# Altium schematic sheet PowerManager.SchDoc
size A4
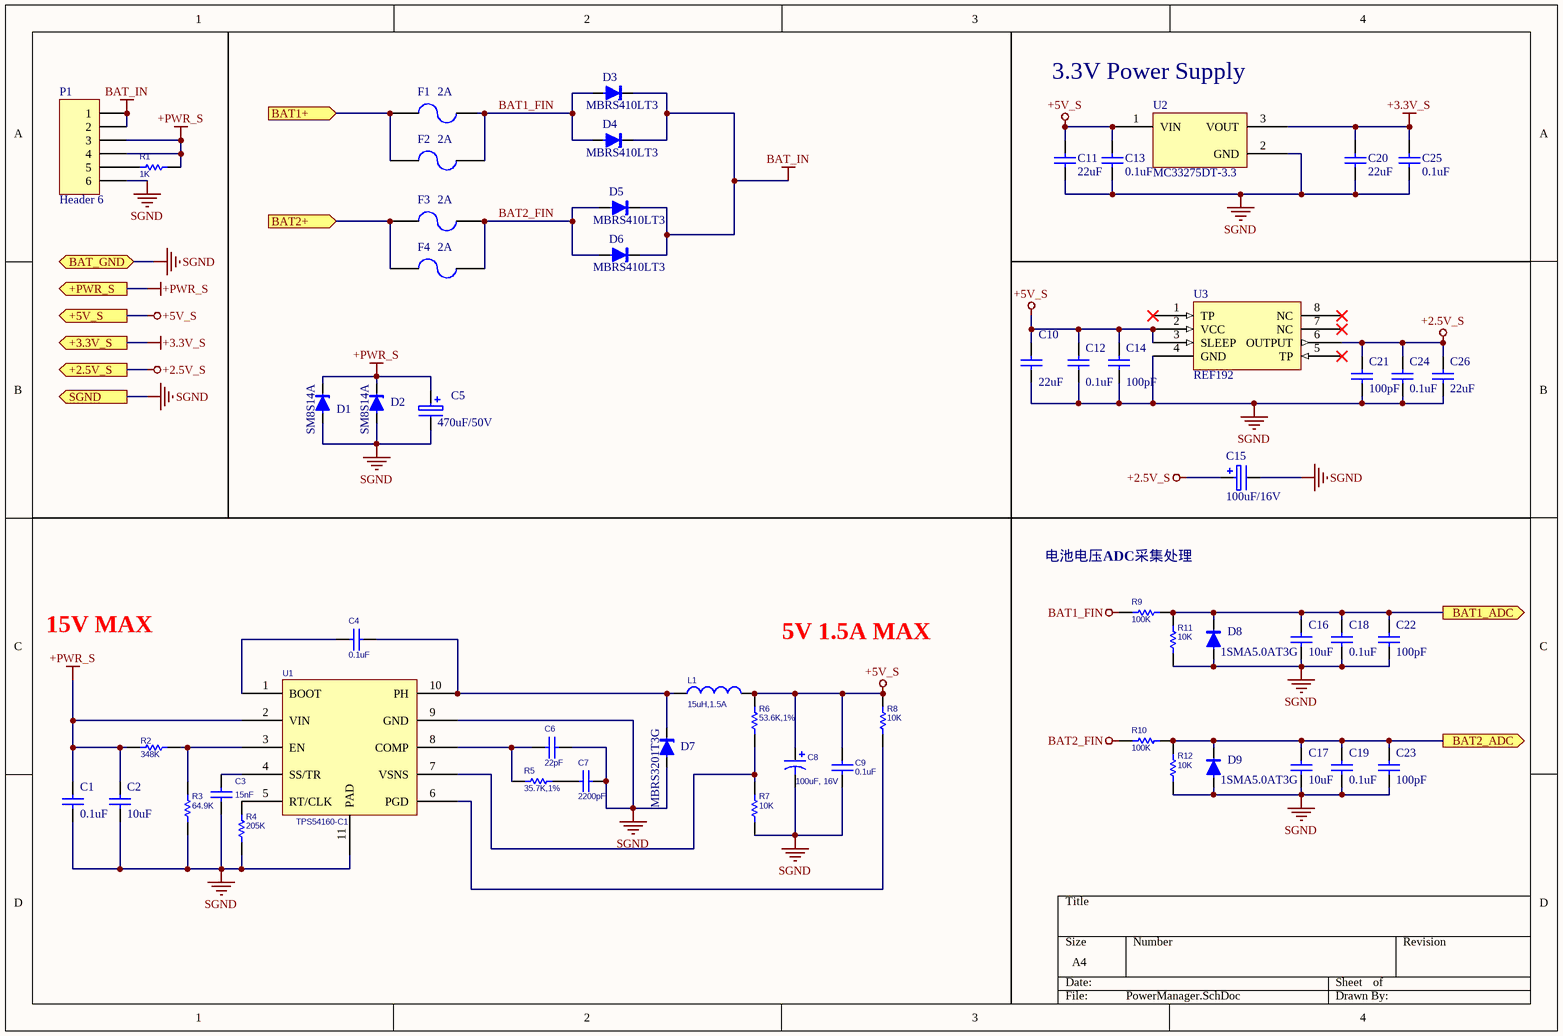
[diagram p0: PowerManager.SchDoc]

## Parts
C1  0.1uF  [C0805]
C2  10uF  [C1206]
C3  15nF  [C0805]
C4  0.1uF  [C0805]
C5  470uF/50V  [CT7343-E]
C6  22pF  [R0805]
C7  2200pF  [C0805]
C8  100uF, 16V  [CT7343-E]
C9  0.1uF  [C0805]
C10  22uF  [C1206]
C11  22uF  [C1206]
C12  0.1uF  [C0805]
C13  0.1uF  [C0805]
C14  100pF  [C0805]
C15  100uF/16V  [CT7343-E]
C16  10uF  [C1206]
C17  10uF  [C1206]
C18  0.1uF  [C1206]
C19  0.1uF  [C1206]
C20  22uF  [C1206]
C21  100pF  [C0805]
C22  100pF  [C1206]
C23  100pF  [C1206]
C24  0.1uF  [C0805]
C25  0.1uF  [C0805]
C26  22uF  [C1206]
D1  SM8S14A  [DO-218AB]
D2  SM8S14A  [DO-218AB]
D3  MBRS410LT3  [SMC]
D4  MBRS410LT3  [SMC]
D5  MBRS410LT3  [SMC]
D6  MBRS410LT3  [SMC]
D7  MBRS3201T3G  [DO-218AB]
D8  1SMA5.0AT3G  [SMA-S]
D9  1SMA5.0AT3G  [SMA-S]
F1  2A  [F1812]
F2  2A  [F1812]
F3  2A  [F1812]
F4  2A  [F1812]
L1  15uH,1.5A  [L5050-P]
P1  Header 6  [DS1X6-2.54]
R1  1K  [R0805]
R2  348K  [R0805]
R3  64.9K  [R0805]
R4  205K  [R0805]
R5  35.7K,1%  [R0805]
R6  53.6K,1%  [R0805]
R7  10K  [R0805]
R8  10K  [R0805]
R9  100K  [R0805]
R10  100K  [R0805]
R11  10K  [R0805]
R12  10K  [R0805]
U1  TPS54160-C1  [TSSO3X5-G10]
U2  MC33275DT-3.3  [TO-252]
U3  REF192  [SO-8]

## Ports
+2.5V_S (out), +3.3V_S (out), +5V_S (out), +PWR_S (out), BAT1+ (in), BAT1_ADC (out), BAT2+ (in), BAT2_ADC (out), BAT_GND, SGND (out)

## Nets
+2.5V_S: C15.1 C21.2 C24.2 C26.2 U3.6(OUTPUT) ; port +2.5V_S
+3.3V_S: C20.1 C25.2 U2.3(VOUT) ; port +3.3V_S
+5V_S: C8.1 C9.1 C10.2 C11.1 C12.2 C13.2 C14.2 L1.2 R6.2 R8.2 U2.1(VIN) U3.2(VCC) U3.3(SLEEP) ; port +5V_S
+PWR_S: C1.2 C2.2 C5.1 D1.2(K) D2.2(K) P1.3 P1.4 R1.1 R2.1 U1.2(VIN) ; port +PWR_S
BAT1_FIN: D3.1(A) D4.1(A) F1.2 F2.2 R9.1
BAT2_FIN: D5.1(A) D6.1(A) F3.2 F4.2 R10.1
BAT_IN: D3.2(K) D4.2(K) D5.2(K) D6.2(K) P1.1 P1.2
SGND: C1.1 C2.1 C3.1 C5.2 C6.1 C7.1 C8.2 C9.2 C10.1 C11.2 C12.1 C13.1 C14.1 C15.2 C16.1 C17.1 C18.1 C19.1 C20.2 C21.1 C22.1 C23.1 C24.1 C25.1 C26.1 D1.1(A) D2.1(A) D7.1(A) D8.1(A) D9.1(A) P1.6 R3.1 R4.1 R7.1 R11.2 R12.2 U1.9(GND) U1.11(PAD) U2.2(GND) U3.4(GND) ; port BAT_GND, port SGND
BAT1+: F1.1 F2.1 ; port BAT1+
BAT1_ADC: C16.2 C18.2 C22.2 D8.2(K) R9.2 R11.1 ; port BAT1_ADC
BAT2+: F3.1 F4.1 ; port BAT2+
BAT2_ADC: C17.2 C19.2 C23.2 D9.2(K) R10.2 R12.1 ; port BAT2_ADC
NetC3_2: C3.2 U1.4(SS/TR)
NetC4_1: C4.1 D7.2(K) L1.1 U1.10(PH)
NetC4_2: C4.2 U1.1(BOOT)
NetC6_2: C6.2 R5.2 U1.8(COMP)
NetC7_2: C7.2 R5.1
NetP1_5: P1.5 R1.2
NetR2_2: R2.2 R3.2 U1.3(EN)
NetR4_2: R4.2 U1.5(RT/CLK)
NetR6_1: R6.1 R7.2 U1.7(VSNS)
NetR8_1: R8.1 U1.6(PGD)

Not connected (* = marked no-connect by the designer): U3 1(TP)* 5(TP)* 7(NC)* 8(NC)*

## Notes on the sheet
- (near U2) 3.3V Power Supply
- (near R9) 电池电压ADC采集处理
- 15V MAX
- 5V 1.5A MAX

## Library data of the parts
C1 C2 C10-C14 C16-C26 = CAP: Published: 8-Jun-2000; LatestRevisionDate: 17-Jul-2002; LatestRevisionNote: Re-released for DXP Platform.; PackageReference: RAD-0.3; Publisher: Altium Limited
  C1 C12 C13 C18 C19 C24 C25: Value: 0.1uF
  C2 C16 C17: Value: 10uF
  C10 C11 C20 C26: Value: 22uF
  C14 C21-C23: Value: 100pF
C3 = Cap: CAP, CERAMIC, 15nF, 16V, X5R, 0603; Published: 8-Jun-2000; LatestRevisionDate: 17-Jul-2002; LatestRevisionNote: Re-released for DXP Platform.; PackageReference: RAD-0.3; Publisher: Altium Limited; Value: 15nF
C4 C9 = Cap: CAP, CERAMIC, 0.1UF, 16V, X5R, 0603; Value: 15nF; Published: 8-Jun-2000; LatestRevisionDate: 17-Jul-2002; LatestRevisionNote: Re-released for DXP Platform.; PackageReference: RAD-0.3; Publisher: Altium Limited
C5 = ELECTRO: Electrolytic Capacitor
C6 C7 = Cap: Capacitor; Value: 15nF; Published: 8-Jun-2000; LatestRevisionDate: 17-Jul-2002; LatestRevisionNote: Re-released for DXP Platform.; PackageReference: RAD-0.3; Publisher: Altium Limited
C8 = Cap Pol1: Polarized Capacitor (Radial); Value: 10uF; Published: 8-Jun-2000; LatestRevisionDate: 17-Jul-2002; LatestRevisionNote: Re-released for DXP Platform.; PackageReference: RB7.6-15; Publisher: Altium Limited
C15 = CAP-ELECTRO: Electrolytic Capacitor
D1-D7 = DIODE-ZENER: Small Signal Zener Diodes
D8 D9 = DIODE-SWITCHING: Silicon Epitaxial Planar Diodes
F1-F4 = FUSE2: Fuse
L1 = Inductor: Code_IEC: 1005; Value: 10mH; Published: 8-Jun-2000; LatestRevisionDate: 29-May-2009; LatestRevisionNote: IPC-7351 Footprint Added.; PackageReference: 0402-A; Publisher: Altium Limited; PackageDescription: Chip Inductor; Code_JEITA: 0402
P1 = Header 6: Header, 6-Pin; LatestRevisionDate: 17-Jul-2002; LatestRevisionNote: Re-released for DXP Platform.; Publisher: Altium Limited
R1 R3-R12 = Res1: Resistor; Value: 348K; Published: 8-Jun-2000; LatestRevisionDate: 17-Jul-2002; LatestRevisionNote: Re-released for DXP Platform.; PackageReference: AXIAL-0.3; Publisher: Altium Limited
R2 = Res1: Resistor; Published: 8-Jun-2000; LatestRevisionDate: 17-Jul-2002; LatestRevisionNote: Re-released for DXP Platform.; PackageReference: AXIAL-0.3; Publisher: Altium Limited; Value: 348K
U2 = MC78MXX: 3-Terminal 0.5A Positive Voltage Regulator; Published: 24-Mar-1999; LatestRevisionDate: 17-Jul-2002; LatestRevisionNote: Re-released for DXP Platform.; PackageReference: D2PAK; Publisher: Altium Limited; Code_JEDEC: SMD-220
U3 = REF192/5/7